# Altium schematic sheet Sheet2.SchDoc
size A3; SheetNumber: 4; SheetTotal: 4
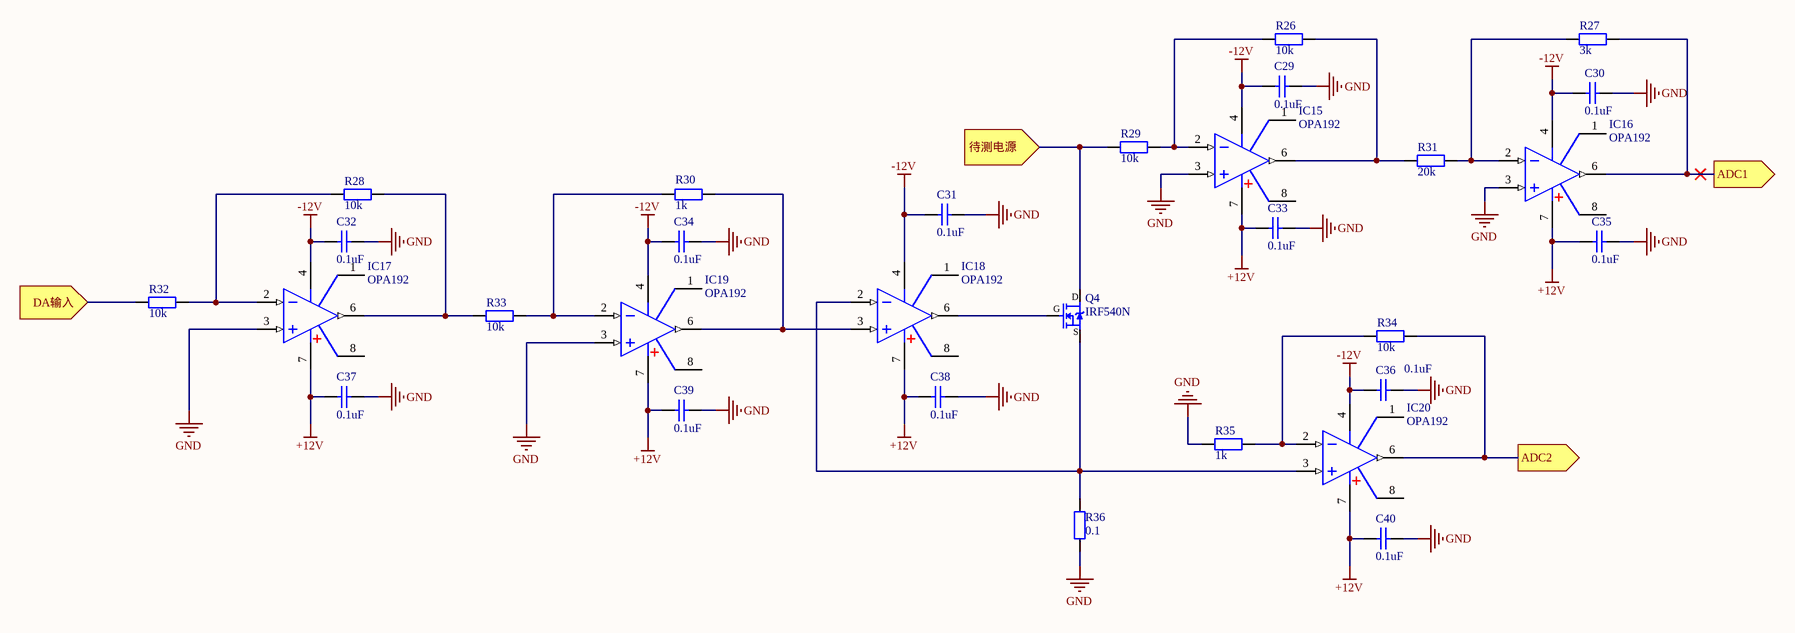
[diagram p0: Sheet2.SchDoc]

## Parts
C29  0.1uF  [瓷片电容]
C30  0.1uF  [瓷片电容]
C31  0.1uF  [瓷片电容]
C32  0.1uF  [瓷片电容]
C33  0.1uF  [瓷片电容]
C34  0.1uF  [瓷片电容]
C35  0.1uF  [瓷片电容]
C36  0.1uF  [瓷片电容]
C37  0.1uF  [瓷片电容]
C38  0.1uF  [瓷片电容]
C39  0.1uF  [瓷片电容]
C40  0.1uF  [瓷片电容]
IC15  OPA192  [SOP8_N]
IC16  OPA192  [SOP8_N]
IC17  OPA192  [SOP8_N]
IC18  OPA192  [SOP8_N]
IC19  OPA192  [SOP8_N]
IC20  OPA192  [SOP8_N]
Q4  IRF540N  [TO263-3B]
R26  10k  [RS 1/4W]
R27  3k  [RS 1/4W]
R28  10k  [RS 1/4W]
R29  10k  [RS 1/4W]
R30  1k  [RS 1/4W]
R31  20k  [RS 1/4W]
R32  10k  [RS 1/4W]
R33  10k  [RS 1/4W]
R34  10k  [RS 1/4W]
R35  1k  [RS 1/4W]
R36  0.1  [RS 1/4W]

## Ports
ADC1 (out), ADC2 (out), DA输入 (in), 待测电源 (in)

## Nets
+12V: C33.1 C35.1 C37.1 C38.1 C39.1 C40.1 IC15.7(V+) IC16.7(V+) IC17.7(V+) IC18.7(V+) IC19.7(V+) IC20.7(V+)
-12V: C29.1 C30.1 C31.1 C32.1 C34.1 C36.1 IC15.4(V-) IC16.4(V-) IC17.4(V-) IC18.4(V-) IC19.4(V-) IC20.4(V-)
GND: C29.2 C30.2 C31.2 C32.2 C33.2 C34.2 C35.2 C36.2 C37.2 C38.2 C39.2 C40.2 IC15.3(IN+) IC16.3(IN+) IC17.3(IN+) IC19.3(IN+) R35.1 R36.1
ADC1: IC16.6(OUT) R27.2 ; port ADC1
ADC2: IC20.6(OUT) R34.2 ; port ADC2
DA输入: R32.1 ; port DA输入
待测电源: Q4.2(S) R29.1 ; port 待测电源
NetIC15_2: IC15.2(IN-) R26.1 R29.2
NetIC15_6: IC15.6(OUT) R26.2 R31.1
NetIC16_2: IC16.2(IN-) R27.1 R31.2
NetIC17_2: IC17.2(IN-) R28.1 R32.2
NetIC17_6: IC17.6(OUT) R28.2 R33.1
NetIC18_2: IC18.2(IN-) IC20.3(IN+) Q4.3(D) R36.2
NetIC18_3: IC18.3(IN+) IC19.6(OUT) R30.2
NetIC18_6: IC18.6(OUT) Q4.1(G)
NetIC19_2: IC19.2(IN-) R30.1 R33.2
NetIC20_2: IC20.2(IN-) R34.1 R35.2

Not connected (* = marked no-connect by the designer): IC15 1 8; IC16 1 8; IC17 1 8; IC18 1 8; IC19 1 8; IC20 1 8

## Library data of the parts
C29-C40 = Cap_DIP: 直插电容; Value: 100nF; Voltage: 63V; Published: 8-Jun-2000; Revision: July-2002: Re-released for DXP Platform.; Publisher: Altium Limited; 实物样品照片: https://item.taobao.com/item.htm?spm=a230r.1.14.32.21fd24b7VWml4d&id=37914290992&ns=1&abbucket=13#detail
IC15-IC20 = OPA192: High-Voltage, Rail-to-Rail Input/Output, 5µV, 0.2µV/˚C, Precision Operational Amplifier; BOM名称: 单路精密运放; 版权归属: 源创客; 学习资源: www.ooocke.com
Q4 = IRF540N: N沟场 100V/22A; BOM名称: 效应管; 版权归属: 源创客; 学习资源: www.ooocke.com; 描述: N沟场 100V/22A
R26-R36 = Res_DIP: 直插电阻